# EAGLE design Bluetooth_Mate_4.0 (EAGLE 9.0.1)
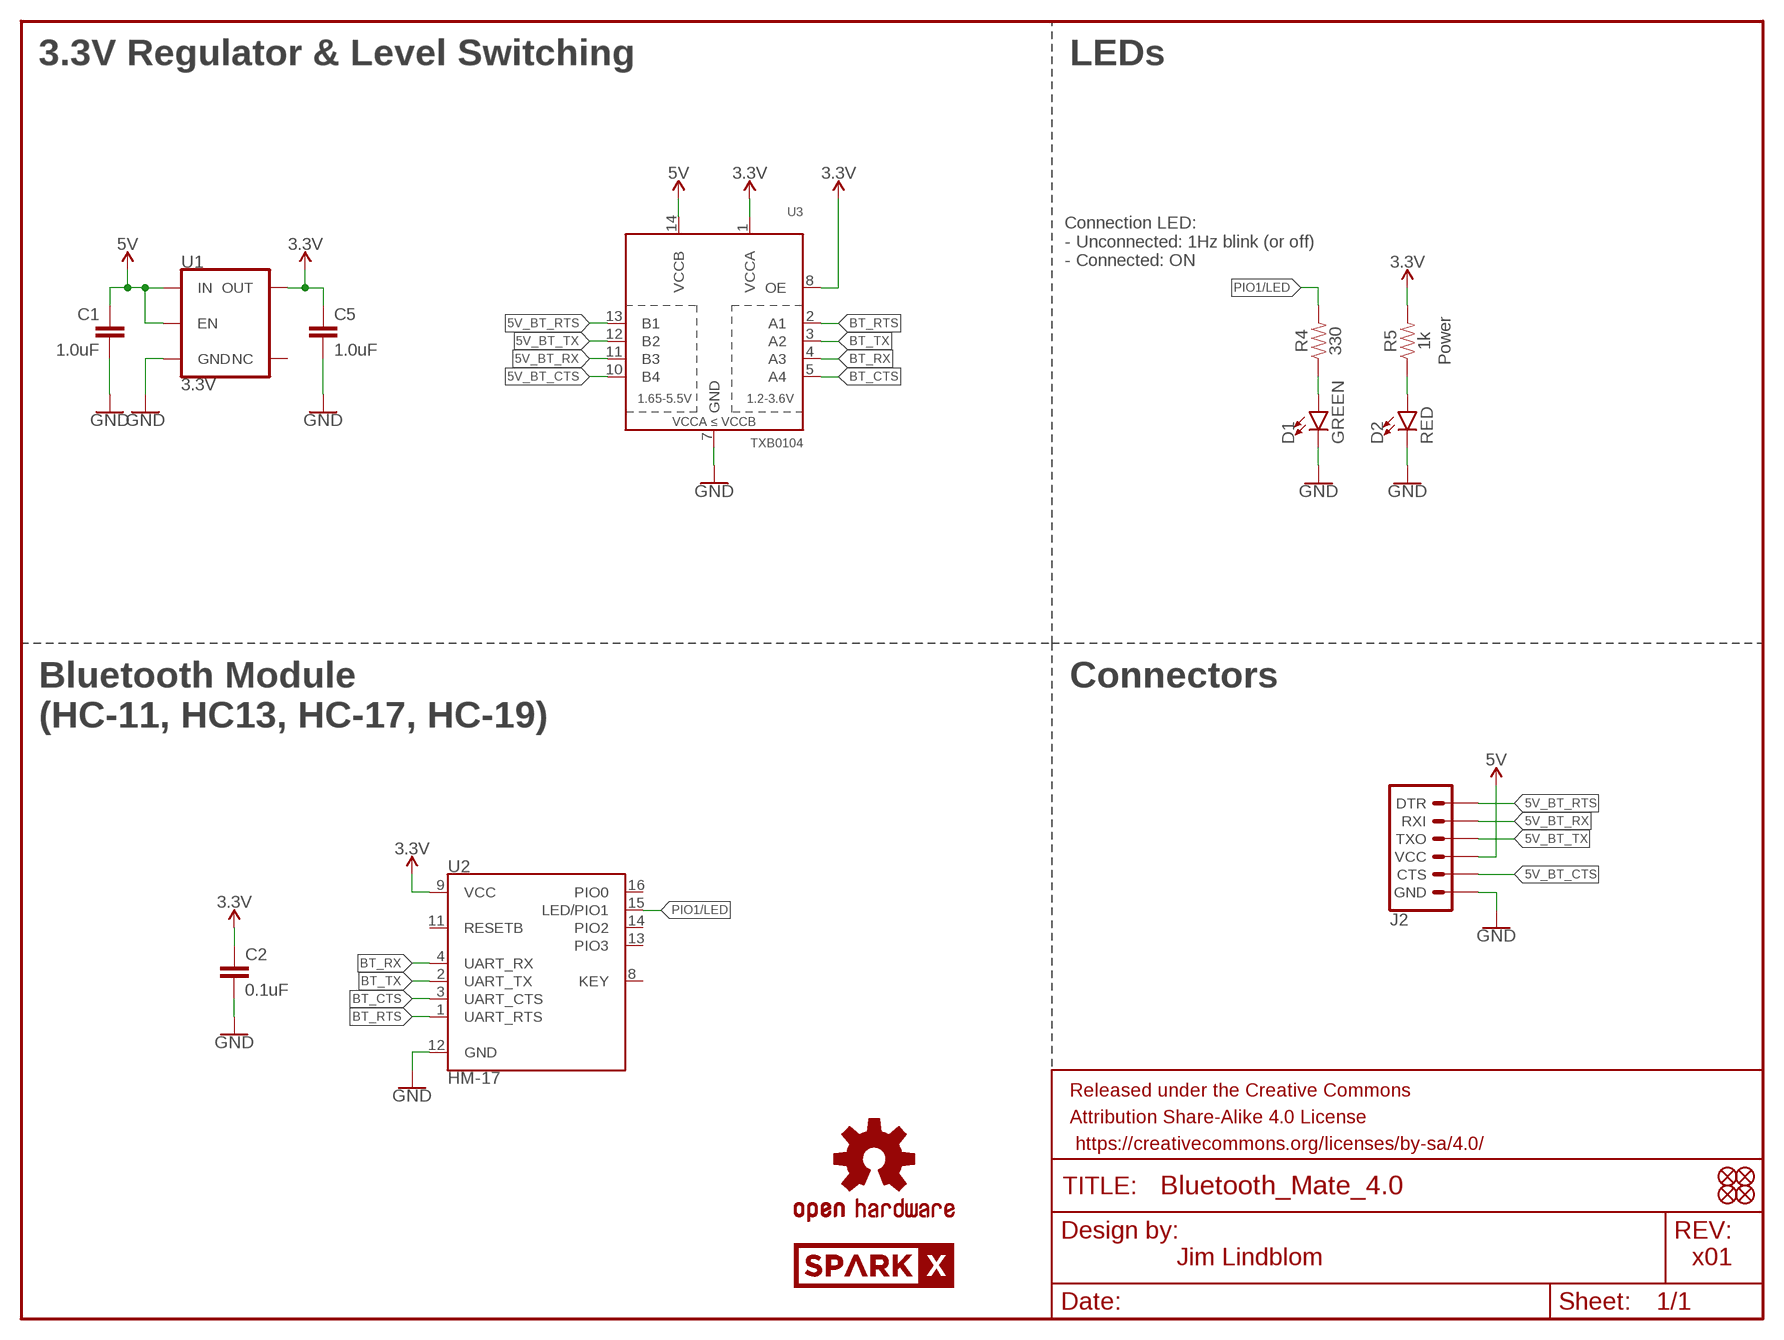
[diagram p0: schematic, sheet 1]

## Parts
C1  1.0uF  1.0UF-0603-16V-10%  [0603]
C2  0.1uF  0.1UF-0603-25V-(+80/-20%)  [0603]
C5  1.0uF  1.0UF-0603-16V-10%  [0603]
D1  GREEN  LED-GREEN0603  [LED-0603]
D2  RED  LED-RED0603  [LED-0603]
FD1  FIDUCIALUFIDUCIAL  [FIDUCIAL-MICRO]
FD2  FIDUCIALUFIDUCIAL  [FIDUCIAL-MICRO]
FD3  FIDUCIALUFIDUCIAL  [FIDUCIAL-MICRO]
FD4  FIDUCIALUFIDUCIAL  [FIDUCIAL-MICRO]
FRAME1  FRAME-LETTER  [CREATIVE_COMMONS]
J2  6_PIN_SERIAL_TARGETNO_SILK  [1X06_NO_SILK]
LOGO1  OSHW-LOGOMINI  [OSHW-LOGO-MINI]
LOGO3  SPARKX-LOGO5  [SPARKX-LARGE]
R4  330  330OHM-0603-1/10W-1%  [0603]
R5  1k  1KOHM-0603-1/10W-1%  [0603]
U1  3.3V  V_REG_AP2112K-3.3V  [SOT23-5]
U2  HM-17  [HM-11]
U3  TXB0104  TXB0104PWR  [TSSOP14]

## Nets
3.3V: C2.1 C5.1 R5.2 U1.5(OUT) U2.9(VCC) U3.1(VCCA) U3.8(OE)
5V: C1.1 J2.4(VCC) U1.1(IN) U1.3(EN) U3.14(VCCB)
5V_BT_CTS: J2.5(CTS) U3.10(B4)
5V_BT_RTS: J2.1(DTR) U3.13(B1)
5V_BT_RX: J2.2(RXI) U3.11(B3)
5V_BT_TX: J2.3(TXO) U3.12(B2)
BT_CTS: U2.3(UART_CTS) U3.5(A4)
BT_RTS: U2.1(UART_RTS) U3.2(A1)
BT_RX: U2.4(UART_RX) U3.4(A3)
BT_TX: U2.2(UART_TX) U3.3(A2)
GND: C1.2 C2.2 C5.2 D1.C D2.C J2.6(GND) U1.2(GND) U2.12(GND) U3.7(GND)
N$2: D1.A R4.1
N$3: D2.A R5.1
PIO1/LED: R4.2 U2.15(LED/PIO1)
Unconnected: U1.4(NC) U2.8(KEY) U2.11(RESETB) U2.13(PIO3) U2.14(PIO2) U2.16(PIO0)

## Notes on the sheet
- 3.3V Regulator & Level Switching | LEDs
- Connection LED:
  - Unconnected: 1Hz blink (or off)
  - Connected: ON
- Power
- Bluetooth Module
  (HC-11, HC13, HC-17, HC-19)
- Connectors
- Jim Lindblom | x01

## Library data of the parts
C1 C5 = SparkFun-Capacitors:1.0UF: 1µF ceramic capacitors A capacitor is a passive two-terminal electrical component used to store electrical energy temporarily in an electric field.; PROD_ID: CAP-00868
C2 = SparkFun-Capacitors:0.1UF: 0.1µF ceramic capacitors A capacitor is a passive two-terminal electrical component used to store electrical energy temporarily in an electric field.; PROD_ID: CAP-00810
D1 = SparkFun-LED:LED-GREEN: Green SMD LED Used in manufacturing of various products at SparkFun Packages: 0603 - SMD 0603 package [Product Link] <http://www.futureelectronics.com/en/technologies/semiconductors/optoelectronics/leds/Pages/9894312-LTST-C190GKT.aspx?CrossPart=HSMG-C190&IM=0> LilyPad 1206 - SMD1206 LilyPad package [Product Link] <http://www.futureelectronics.com/en/Technologies/Product.aspx?ProductID=IN150NGHARVATEKCORPORATION2049943&IM=0> 1206 - SMD1206 package [Product Link] <http://www.futureelectronics.com/en/technologies/semiconductors/optoelectronics/leds/Pages/8315665-LTST-C150KGKT.aspx?IM=0> 1206 Bottom Mount -SMD 1206 Bottom Mount [Product Link] <http://www.digikey.com/product-detail/en/lite-on-inc/LTST-C230KGKT/160-1456-1-ND/386854> SparkFun Products: Pro Mini 328 -5V <https://www.sparkfun.com/products/821> RedBoard <https://www.sparkfun.com/products/12757> MP3 Trigger <https://www.sparkfun.com/products/13720> Makey Makey <https://www.sparkfun.com/products/11076>; PROD_ID: DIO-00821
D2 = SparkFun-LED:LED-RED: Red SMD LED Used in manufacturing of most products at SparkFun Packages: 0603 - SMD 0603 package [Product Link] <http://docs.avagotech.com/docs/AV02-0551EN> 0603 SMART - SMD 0603 SMART package ( more efficient and expensive)[Product Link] <http://www.osram-os.com/Graphics/XPic2/00077099_0.pdf> 1206 - SMD1206 package [Product Link] <https://www.sparkfun.com/datasheets/DevTools/LilyPad/Q150OVS4.pdff> SparkFun Products: Pro Mini 328 -5V <https://www.sparkfun.com/products/821> RedBoard <https://www.sparkfun.com/products/12757> IOIO-OTG <https://www.sparkfun.com/products/13613>; PROD_ID: DIO-00819
FD1-FD4 = SparkFun-Aesthetics:FIDUCIAL: Fiducial Alignment Points Point-of-reference for pick-and-place machines and other optical instruments.
FRAME1 = SparkFun-Aesthetics:FRAME-LETTER: Schematic Frame - Letter Standard 8.5x11 US Letter frame
J2 = SparkFun-Connectors:6_PIN_SERIAL_TARGET: 6-pin header connection for use with the "FTDI BASIC" pinout - TARGET SIDE. Also known as "Arduino Serial Program Header". It is used to mate with our FTDI Basic serial programmers using the Arduino IDE. Note, this device has "TARGET" in the name. It is intended to be used on a design that contains a target micro-controller that you wish to program. The "sister" device, named "CABLE" is inteneded to be used on a design that usually lives on the end of your USB cable and prvides the converter chip (FTDI232 or FTDI231x) to commnicate serial RX/TX. You can populate with some of these: Break Away Headers - Straight <https://www.sparkfun.com/products/116> (PRT-00116) For reference (or to suit your programming needs) check out these designs: SparkFun FTDI Basic Breakout - 5V <https://www.sparkfun.com/products/9716> (DEV-09716) SparkFun FTDI Basic Breakout - 3.3V <https://www.sparkfun.com/products/9873> (DEV-09873) SparkFun FTDI SmartBasic <https://www.sparkfun.com/products/12935> (DEV-12935) SparkFun Beefy 3 - FTDI Basic Breakout <https://www.sparkfun.com/products/13746> (DEV-13746)
LOGO1 = SparkFun-Aesthetics:OSHW-LOGO: Open-Source Hardware (OSHW) Logo This logo indicates the piece of hardware it is found on incorporates a OSHW license and/or adheres to the definition of open source hardware found here: http://freedomdefined.org/OSHW
LOGO3 = SparkX:SPARKX-LOGO
R4 = SparkFun-Resistors:330OHM: 330Ω resistor A resistor is a passive two-terminal electrical component that implements electrical resistance as a circuit element. Resistors act to reduce current flow, and, at the same time, act to lower voltage levels within circuits. - Wikipedia; PROD_ID: RES-00818
R5 = SparkFun-Resistors:1KOHM: 1kΩ resistor A resistor is a passive two-terminal electrical component that implements electrical resistance as a circuit element. Resistors act to reduce current flow, and, at the same time, act to lower voltage levels within circuits. - Wikipedia; PROD_ID: RES-07856
U1 = SparkFun-IC-Power:V_REG_AP2112: AP2112 - 600mA CMOS LDO Regulator w/ Enable The AP2112 is CMOS process low dropout linear regulator with enable function, the regulator delivers a guaranteed 600mA (min.) continuous load current. Features Output Voltage Accuracy: ±1.5% Output Current: 600mA (Min.) Foldback Short Current Protection: 50mA Enable Function to Turn ON/OFF VOUT Low Dropout Voltage (3.3V): 250mV (Typ.) @IOUT=600mA Excellent Load Regulation: 0.2%/A (Typ.) Excellent Line Regulation: 0.02%/V (Typ.) Low Quiescent Current: 55μA (Typ.) Low Standby Current: 0.01μA (Typ.) Low Output Noise: 50μVRMS PSRR: 100Hz -65dB, 1kHz -65dB OTSD Protection Stable with 1.0μF Flexible Cap: Ceramic, Tantalum and Aluminum Electrolytic Operation Temperature Range: -40°C to 85°C ESD: MM 400V, HBM 4000V; PROD_ID: VREG-12457
U2 = Qwiic-Bluetooth-HC1x:HM-17
U3 = SparkFun-IC-Comms:TXB0104PWR: 4-Bit Bi-Directional Level Shifter 1.2V-3.6V (VCCA) to 1.65V-5.5V (VCCB) bi-directional level shifter with auto direction sensing. Max data rate - VCCA 1.8V: 20Mbps (50ns), VCCA 3.3V: 100Mbps (10ns) Digikey: 296-21929-1-ND (TSSOP) Datasheet <http://cdn.sparkfun.com/datasheets/BreakoutBoards/txb0104.pdf> SparkFun Products SparkFun Cellular Shield - MG2639 <https://www.sparkfun.com/products/13120> (CEL-13120) SparkFun Level Shifting microSD Breakout <https://www.sparkfun.com/products/13743> (DEV-13743) SparkFun Voltage-Level Translator Breakout - TXB0104 <https://www.sparkfun.com/products/11771> (BOB-11771) SparkFun Block for Intel® Edison - UART <https://www.sparkfun.com/products/13040> (DEV-13040) SparkFun Block for Intel® Edison - Arduino <https://www.sparkfun.com/products/13036> (DEV-13036); PROD_ID: IC-13929

## Board
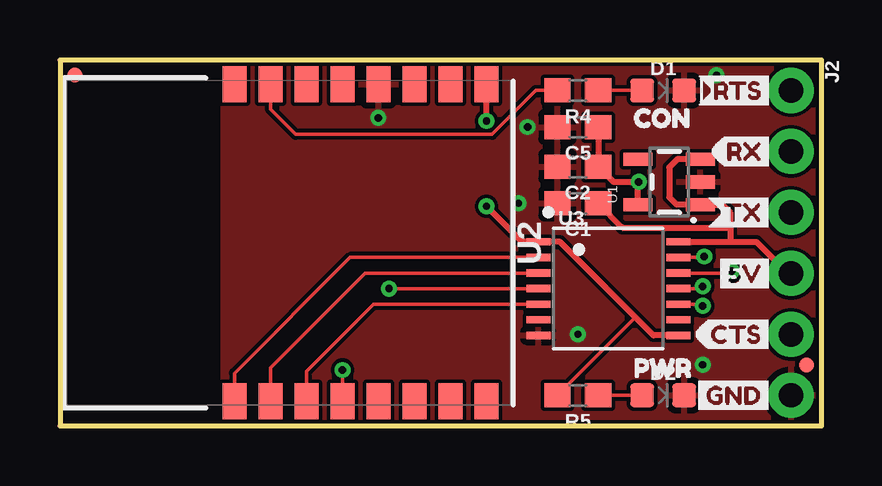
[diagram p1: board, top side]
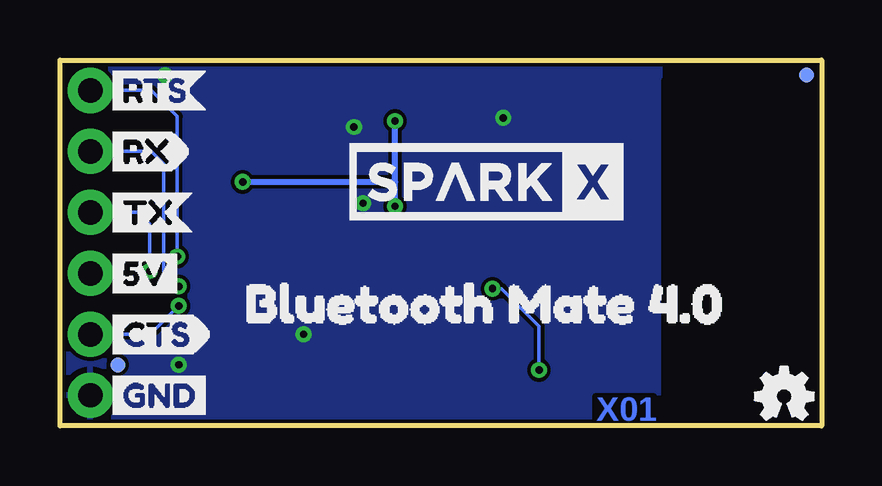
[diagram p2: board, bottom side, seen from below]

Size 31.75 x 15.24 mm. Coordinates in mm from the lower left corner, seen from the top.
Outline: 0,0 31.75,0 31.75,15.24 0,15.24 0,0
Copper layers (1*16): Top 0.035mm / dielectric 1.5mm / Bottom 0.035mm
Design rules "SparkFun-2-layer-PCBWay-LIMIT": minimum track width 6mil, minimum drill 0.3mm, track to track 6mil, track to pad 6mil, pad to pad 6mil, via to via 6mil, smd to smd 6mil, copper to edge 6mil, drill to drill 6mil, minimum pad ring 7mil, minimum via ring 7mil, stop-mask expansion 4mil, vias tented up to drill 25mil, thermal gap 10mil

### Footprints (pad centres in the part's own frame; a part is rotated, then mirrored left to right if it is on the bottom)
0603 = smd 1.1 x 1: 1 -0.85,0; 2 0.85,0
LED-0603 = smd 1 x 1: A -0.877,0; C 0.877,0
FIDUCIAL-MICRO = smd 0.635 x 0.635: 1 0,0
1X06_NO_SILK = drill 1.016 pad 1.88: 1 0,0; 2 2.54,0; 3 5.08,0; 4 7.62,0; 5 10.16,0; 6 12.7,0
SOT23-5 = smd 0.55 x 1.2: 1 -0.95,-1.3; 2 0,-1.3; 3 0.95,-1.3; 4 0.95,1.3; 5 -0.95,1.3
HM-11 = smd 1.5 x 1: 1 -6.6,2.25; 2 -6.6,0.75; 3 -6.6,-0.75; 4 -6.6,-2.25; 5 -6.6,-3.75; 6 -6.6,-5.25; 7 -6.6,-6.75; 8 -6.6,-8.25; 9 6.6,-8.25; 10 6.6,-6.75; 11 6.6,-5.25; 12 6.6,-3.75; 13 6.6,-2.25; 14 6.6,-0.75; 15 6.6,0.75; 16 6.6,2.25
TSSOP14 = smd 0.305 x 0.991: 1 -1.95,-2.918; 2 -1.3,-2.918; 3 -0.65,-2.918; 4 0,-2.918; 5 0.65,-2.918; 6 1.3,-2.918; 7 1.95,-2.918; 8 1.95,2.918; 9 1.3,2.918; 10 0.65,2.918; 11 0,2.918; 12 -0.65,2.918; 13 -1.3,2.918; 14 -1.95,2.918

### Placement (x,y rotation side)
C1  21.59,9.27 180 top
C2  21.59,10.79 180 top
C5  21.59,12.45 180 top
D1  25.15,13.97 0 top
D2  25.15,1.27 0 top
FD1  0.64,14.61 0 top
FD2  31.11,2.54 0 top
FD3  29.34,2.54 0 bottom
FD4  0.64,14.61 0 bottom
FRAME1  20.95,-15.88 0 top  (outside the outline)
J2  30.48,13.97 270 top
LOGO1  1.56,1.24 0 bottom
LOGO3  13.97,10.16 0 bottom
R4  21.59,13.97 180 top
R5  21.59,1.27 180 top
U1  25.4,10.16 90 top
U2  9.53,7.62 90 top
U3  22.86,5.71 270 top
U$1  [CTS13]  26.42,3.81 0 top
U$2  [5V9]  27.15,6.35 0 top
U$3  [GND8]  26.26,1.27 0 top
U$4  [RX10]  27.08,11.43 0 top
U$5  [TX9]  26.99,8.89 0 top
U$6  [RTS12]  26.54,13.97 0 top
U$7  [RTS13]  30.07,13.97 0 bottom
U$8  [TX11]  30.04,8.89 0 bottom
U$9  [RX9]  30.07,11.43 0 bottom
U$10  [5V6]  30.07,6.35 0 bottom
U$11  [CTS8]  30.07,3.81 0 bottom
U$12  [GND13]  30.04,1.27 0 bottom
U$13  [BLUETOOTH_MATE_4#06]  25.4,5.08 0 bottom
U$14  [PWR6]  23.24,2.41 0 top
U$15  [CON7]  23.24,12.83 0 top

### Tracks (layer width: path | path; a pad name or v marks a point on that pad's centre or on a via)
3.3V  (via drill 0.3)
  Top 0.152: R5.2 23.95,4.48 24.04,4.48
  Top 0.254: C5.1 C2.1 23.07,10.16 v24.13,10.16 24.1,10.13 U1.5 | v17.78,12.7 v17.77,12.71 U2.9 | U3.8 24.75,3.77 24.04,4.48 20.85,7.67 U3.1 19.26,7.67 v17.78,9.14
  Bottom 0.254: v17.78,9.14 17.78,10.16 | 17.78,10.16 v17.78,12.7 | v24.13,10.16 17.78,10.16
5V
  Top 0.254: U3.14 27.94,7.67 | 27.94,7.67 29.04,7.67 30.35,6.35 J2.4 | 27.94,8.26 27.94,7.67 | 27.94,8.26 27.94,8.89 27.62,9.21 U1.1 25.71,9.21 25.4,9.53 25.4,10.76 25.75,11.11 U1.3 | C1.1 23.46,8.26 27.94,8.26
5V_BT_CTS  (via drill 0.3)
  Top 0.152: U3.10 26.73,5.07 v26.8,4.99
  Bottom 0.152: v26.8,4.99 27.98,3.81 J2.5
5V_BT_RTS  (via drill 0.3)
  Top 0.152: U3.13 26.82,7.01 v26.86,7.05
  Bottom 0.152: v26.86,7.05 26.86,12.89 27.94,13.97 J2.1
5V_BT_RX  (via drill 0.3)
  Top 0.152: U3.11 26.71,5.71 v26.8,5.81
  Bottom 0.152: v26.8,5.81 27.43,6.44 27.43,10.92 27.94,11.43 J2.2
5V_BT_TX  (via drill 0.3)
  Top 0.152: U3.12 27.92,6.37 v28,6.45
  Bottom 0.152: v28,6.45 28,8.41 28.48,8.89 J2.3
BT_CTS
  Top 0.152: U2.3 10.28,2.27 13.07,5.07 U3.5
BT_RTS
  Top 0.152: U3.2 12.1,7.01 7.28,2.19 U2.1
BT_RX  (via drill 0.3)
  Top 0.152: U3.4 v13.72,5.71 | U2.4 v11.78,2.32
  Bottom 0.152: v11.78,2.32 11.78,4.16 13.34,5.71 v13.72,5.71
BT_TX
  Top 0.152: U3.3 12.71,6.37 8.78,2.42 U2.2
GND  (via drill 0.3)
  other vias: 13.27,12.83 19.11,9.27 21.59,3.81 27.37,14.61 19.49,12.45 26.8,2.54
  pour Top (isolate 0.152): 0,0 0,15.24 31.75,15.24 31.75,0
  pour Bottom (isolate 0.152): 6.73,0 6.73,15.24 31.75,15.24 31.75,0
N$2
  Top 0.152: R4.1 D1.A
N$3
  Top 0.152: R5.1 D2.A
PIO1/LED
  Top 0.152: R4.2 19.84,13.97 18.01,12.14 9.83,12.14 8.78,13.2 U2.15

### Text on the board
Bottom: X01